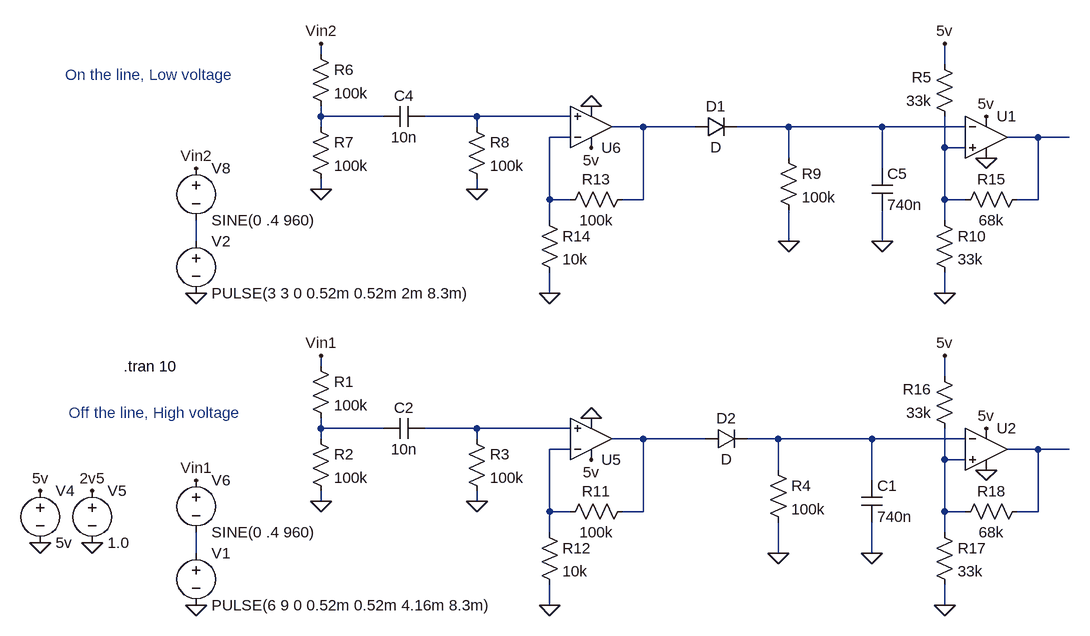
[diagram p0: schematic coupling_3.0.asc]
coupling_3.0.asc, the LTspice schematic file:
Version 4
SHEET 1 1572 680
WIRE -160 -560 -160 -576
WIRE 800 -544 800 -576
WIRE -160 -464 -160 -480
WIRE -64 -464 -160 -464
WIRE 80 -464 0 -464
WIRE 224 -464 80 -464
WIRE -160 -448 -160 -464
WIRE 80 -448 80 -464
WIRE 336 -448 288 -448
WIRE 416 -448 336 -448
WIRE 560 -448 480 -448
WIRE 704 -448 560 -448
WIRE 832 -448 704 -448
WIRE 224 -432 192 -432
WIRE 944 -432 896 -432
WIRE 992 -432 944 -432
WIRE 800 -416 800 -464
WIRE 832 -416 800 -416
WIRE 560 -400 560 -448
WIRE 704 -384 704 -448
WIRE -160 -352 -160 -368
WIRE 80 -352 80 -368
WIRE 192 -336 192 -432
WIRE 224 -336 192 -336
WIRE 336 -336 336 -448
WIRE 336 -336 304 -336
WIRE 800 -336 800 -416
WIRE 832 -336 800 -336
WIRE 944 -336 944 -432
WIRE 944 -336 912 -336
WIRE 192 -304 192 -336
WIRE 800 -304 800 -336
WIRE -352 -272 -352 -304
WIRE 560 -272 560 -320
WIRE 704 -272 704 -320
WIRE 192 -192 192 -224
WIRE 800 -192 800 -224
WIRE -160 -80 -160 -96
WIRE 800 -64 800 -96
WIRE -160 16 -160 0
WIRE -64 16 -160 16
WIRE 80 16 0 16
WIRE 224 16 80 16
WIRE -160 32 -160 16
WIRE 80 32 80 16
WIRE 336 32 288 32
WIRE 432 32 336 32
WIRE 544 32 496 32
WIRE 688 32 544 32
WIRE 832 32 688 32
WIRE 224 48 192 48
WIRE 944 48 896 48
WIRE 992 48 944 48
WIRE 800 64 800 16
WIRE 832 64 800 64
WIRE 544 80 544 32
WIRE 688 96 688 32
WIRE -160 128 -160 112
WIRE 80 128 80 112
WIRE 192 144 192 48
WIRE 224 144 192 144
WIRE 336 144 336 32
WIRE 336 144 304 144
WIRE 800 144 800 64
WIRE 832 144 800 144
WIRE 944 144 944 48
WIRE 944 144 912 144
WIRE 192 176 192 144
WIRE 800 176 800 144
WIRE -352 208 -352 176
WIRE 544 208 544 160
WIRE 688 208 688 160
WIRE 192 288 192 256
WIRE 800 288 800 256
FLAG -352 288 0
FLAG -160 -96 Vin1
FLAG -592 192 0
FLAG -592 112 5v
FLAG -512 192 0
FLAG -512 112 2v5
FLAG -352 96 Vin1
FLAG -160 128 0
FLAG 80 128 0
FLAG -352 -192 0
FLAG -160 -576 Vin2
FLAG -352 -384 Vin2
FLAG -160 -352 0
FLAG 80 -352 0
FLAG 256 64 5v
FLAG 256 0 0
FLAG 192 288 0
FLAG 256 -416 5v
FLAG 256 -480 0
FLAG 192 -192 0
FLAG 560 -272 0
FLAG 704 -272 0
FLAG 544 208 0
FLAG 688 208 0
FLAG 864 -464 5v
FLAG 864 -400 0
FLAG 800 -576 5v
FLAG 800 -192 0
FLAG 864 16 5v
FLAG 864 80 0
FLAG 800 -96 5v
FLAG 800 288 0
SYMBOL voltage -352 192 R0
WINDOW 123 0 0 Left 2
WINDOW 39 0 0 Left 2
SYMATTR InstName V1
SYMATTR Value PULSE(6 9 0 0.52m 0.52m 4.16m 8.3m)
SYMBOL res -176 -96 R0
SYMATTR InstName R1
SYMATTR Value 100k
SYMBOL res -176 16 R0
SYMATTR InstName R2
SYMATTR Value 100k
SYMBOL voltage -592 96 R0
WINDOW 123 0 0 Left 2
WINDOW 39 0 0 Left 2
SYMATTR InstName V4
SYMATTR Value 5v
SYMBOL voltage -512 96 R0
WINDOW 123 0 0 Left 2
WINDOW 39 0 0 Left 2
SYMATTR InstName V5
SYMATTR Value 1.0
SYMBOL voltage -352 80 R0
WINDOW 123 0 0 Left 2
WINDOW 39 0 0 Left 2
SYMATTR InstName V6
SYMATTR Value SINE(0 .4 960)
SYMBOL cap 0 0 R90
WINDOW 0 0 32 VBottom 2
WINDOW 3 32 32 VTop 2
SYMATTR InstName C2
SYMATTR Value 10n
SYMBOL res 64 16 R0
SYMATTR InstName R3
SYMATTR Value 100k
SYMBOL voltage -352 -288 R0
WINDOW 123 0 0 Left 2
WINDOW 39 0 0 Left 2
SYMATTR InstName V2
SYMATTR Value PULSE(3 3 0 0.52m 0.52m 2m 8.3m)
SYMBOL res -176 -576 R0
SYMATTR InstName R6
SYMATTR Value 100k
SYMBOL res -176 -464 R0
SYMATTR InstName R7
SYMATTR Value 100k
SYMBOL voltage -352 -400 R0
WINDOW 123 0 0 Left 2
WINDOW 39 0 0 Left 2
SYMATTR InstName V8
SYMATTR Value SINE(0 .4 960)
SYMBOL cap 0 -480 R90
WINDOW 0 0 32 VBottom 2
WINDOW 3 32 32 VTop 2
SYMATTR InstName C4
SYMATTR Value 10n
SYMBOL res 64 -464 R0
SYMATTR InstName R8
SYMATTR Value 100k
SYMBOL Opamps\\UniversalOpamp2 256 32 M180
SYMATTR InstName U5
SYMBOL res 320 128 R90
WINDOW 0 0 56 VBottom 2
WINDOW 3 32 56 VTop 2
SYMATTR InstName R11
SYMATTR Value 100k
SYMBOL res 176 160 R0
SYMATTR InstName R12
SYMATTR Value 10k
SYMBOL Opamps\\UniversalOpamp2 256 -448 M180
SYMATTR InstName U6
SYMBOL res 320 -352 R90
WINDOW 0 0 56 VBottom 2
WINDOW 3 32 56 VTop 2
SYMATTR InstName R13
SYMATTR Value 100k
SYMBOL res 176 -320 R0
SYMATTR InstName R14
SYMATTR Value 10k
SYMBOL diode 416 -432 R270
WINDOW 0 32 32 VTop 2
WINDOW 3 0 32 VBottom 2
SYMATTR InstName D1
SYMBOL res 544 -416 R0
SYMATTR InstName R9
SYMATTR Value 100k
SYMBOL cap 688 -384 R0
SYMATTR InstName C5
SYMATTR Value 740n
SYMBOL res 528 64 R0
SYMATTR InstName R4
SYMATTR Value 100k
SYMBOL cap 672 96 R0
SYMATTR InstName C1
SYMATTR Value 740n
SYMBOL diode 432 48 R270
WINDOW 0 32 32 VTop 2
WINDOW 3 0 32 VBottom 2
SYMATTR InstName D2
SYMBOL Opamps\\UniversalOpamp2 864 -432 R0
SYMATTR InstName U1
SYMBOL res 816 -448 R180
WINDOW 0 36 76 Left 2
WINDOW 3 36 40 Left 2
SYMATTR InstName R5
SYMATTR Value 33k
SYMBOL res 784 -320 R0
SYMATTR InstName R10
SYMATTR Value 33k
SYMBOL res 928 -352 R90
WINDOW 0 0 56 VBottom 2
WINDOW 3 32 56 VTop 2
SYMATTR InstName R15
SYMATTR Value 68k
SYMBOL Opamps\\UniversalOpamp2 864 48 R0
SYMATTR InstName U2
SYMBOL res 816 32 R180
WINDOW 0 36 76 Left 2
WINDOW 3 36 40 Left 2
SYMATTR InstName R16
SYMATTR Value 33k
SYMBOL res 784 160 R0
SYMATTR InstName R17
SYMATTR Value 33k
SYMBOL res 928 128 R90
WINDOW 0 0 56 VBottom 2
WINDOW 3 32 56 VTop 2
SYMATTR InstName R18
SYMATTR Value 68k
TEXT -464 -80 Left 2 !.tran 10
TEXT -424 -528 Center 2 ;On the line, Low voltage
TEXT -416 -8 Center 2 ;Off the line, High voltage

The netlist it stands for:
* coupling_3.0.asc
V1 N016 0 PULSE(6 9 0 0.52m 0.52m 4.16m 8.3m)
R1 Vin1 N009 100k
R2 N009 0 100k
V4 5v 0 5v
V5 2v5 0 1.0
V6 Vin1 N016 SINE(0 .4 960)
C2 N010 N009 10n
R3 N010 0 100k
V2 N008 0 PULSE(3 3 0 0.52m 0.52m 2m 8.3m)
R6 Vin2 N001 100k
R7 N001 0 100k
V8 Vin2 N008 SINE(0 .4 960)
C4 N002 N001 10n
R8 N002 0 100k
XU5 N010 N013 5v 0 N011 level.2 Avol=1Meg GBW=10Meg Slew=10Meg ilimit=25m rail=0 Vos=0 phimargin=45 en=0 enk=0 in=0 ink=0 Rin=500Meg  ; pins IN+ IN- V+ V- OUT
R11 N011 N013 100k
R12 N013 0 10k
XU6 N002 N005 5v 0 N003 level.2 Avol=1Meg GBW=10Meg Slew=10Meg ilimit=25m rail=0 Vos=0 phimargin=45 en=0 enk=0 in=0 ink=0 Rin=500Meg  ; pins IN+ IN- V+ V- OUT
R13 N003 N005 100k
R14 N005 0 10k
D1 N003 N004 D
R9 N004 0 100k
C5 N004 0 740n
R4 N012 0 100k
C1 N012 0 740n
D2 N011 N012 D
XU1 N007 N004 5v 0 N006 level.2 Avol=1Meg GBW=10Meg Slew=10Meg ilimit=25m rail=0 Vos=0 phimargin=45 en=0 enk=0 in=0 ink=0 Rin=500Meg  ; pins IN+ IN- V+ V- OUT
R5 N007 5v 33k
R10 N007 0 33k
R15 N006 N007 68k
XU2 N015 N012 5v 0 N014 level.2 Avol=1Meg GBW=10Meg Slew=10Meg ilimit=25m rail=0 Vos=0 phimargin=45 en=0 enk=0 in=0 ink=0 Rin=500Meg  ; pins IN+ IN- V+ V- OUT
R16 N015 5v 33k
R17 N015 0 33k
R18 N014 N015 68k
.model D D
.lib standard.dio
.tran 10
* On the line, Low voltage
* Off the line, High voltage
.lib UniversalOpamps2.sub
.backanno
.end